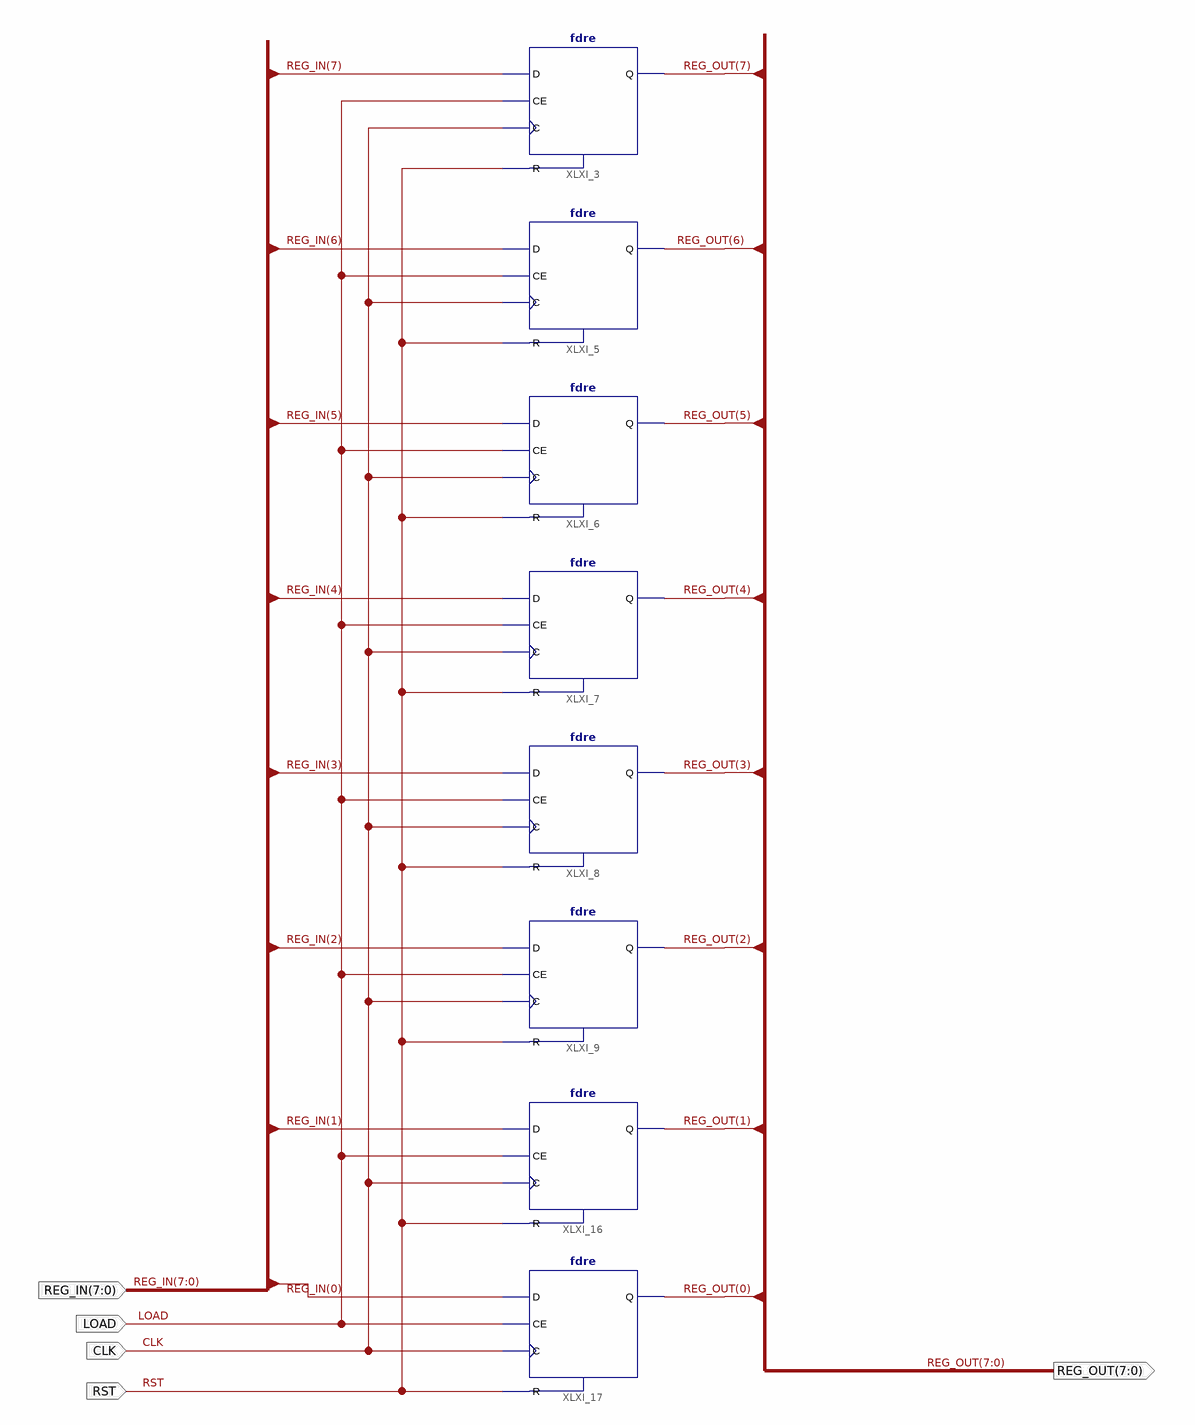
[diagram p0: schematic sheet 1]
// Xilinx ISE schematic reg_sch.sch (spartan3e) as structural Verilog: 8 symbols, 5 ports
module reg_sch (
  input  RST,
  input  CLK,
  input  LOAD,
  input  [7:0] REG_IN,
  output [7:0] REG_OUT
);

  fdre XLXI_3 (.C(CLK), .CE(LOAD), .D(REG_IN[7]), .R(RST), .Q(REG_OUT[7]));
  fdre XLXI_5 (.C(CLK), .CE(LOAD), .D(REG_IN[6]), .R(RST), .Q(REG_OUT[6]));
  fdre XLXI_6 (.C(CLK), .CE(LOAD), .D(REG_IN[5]), .R(RST), .Q(REG_OUT[5]));
  fdre XLXI_7 (.C(CLK), .CE(LOAD), .D(REG_IN[4]), .R(RST), .Q(REG_OUT[4]));
  fdre XLXI_8 (.C(CLK), .CE(LOAD), .D(REG_IN[3]), .R(RST), .Q(REG_OUT[3]));
  fdre XLXI_9 (.C(CLK), .CE(LOAD), .D(REG_IN[2]), .R(RST), .Q(REG_OUT[2]));
  fdre XLXI_16 (.C(CLK), .CE(LOAD), .D(REG_IN[1]), .R(RST), .Q(REG_OUT[1]));
  fdre XLXI_17 (.C(CLK), .CE(LOAD), .D(REG_IN[0]), .R(RST), .Q(REG_OUT[0]));
endmodule
